# Altium project Feeder.PrjPcb (part 1 of 2)
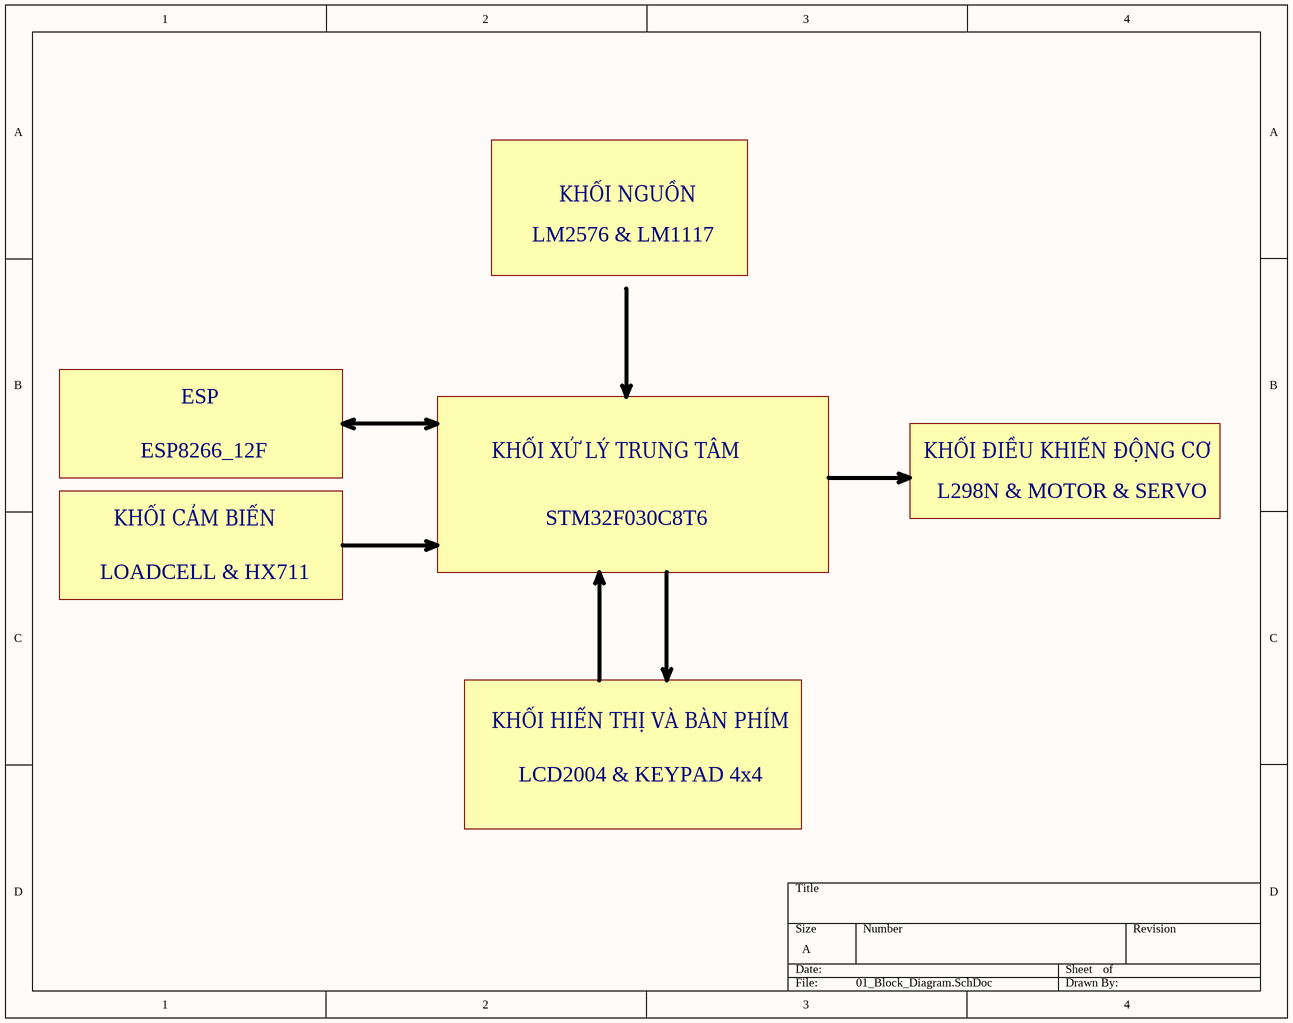
[diagram p0: 01_Block_Diagram.SchDoc]
8 sheets, 125 parts. Net scope: flat (ports and power ports of the same name join across sheets).
Board files: PCB2.PcbDoc, Panel_Feeder.PcbDoc
Sheets:
  01_Block_Diagram.SchDoc
  02_Power_Diagram.SchDoc
  03_MCU.SchDoc
  04_Input.SchDoc
  05_Output.SchDoc
  06_ESP.SchDoc
  07_Power_Supply_AC_to_DC.SchDoc
  08_Power_Supply.SchDoc

## Sheet 01_Block_Diagram.SchDoc
size A; SheetNumber: 1; SheetTotal: 8

### Notes on the sheet
- KHỐI NGUỒN
- LM2576 & LM1117
- ESP
- ESP8266_12F
- KHỐI XỬ LÝ TRUNG TÂM
- KHỐI ĐIỀU KHIỂN ĐỘNG CƠ
- L298N & MOTOR & SERVO
- KHỐI CẢM BIẾN
- STM32F030C8T6
- LOADCELL & HX711
- KHỐI HIỂN THỊ VÀ BÀN PHÍM
- LCD2004 & KEYPAD 4x4

## Sheet 02_Power_Diagram.SchDoc
size A; SheetNumber: 2; SheetTotal: 7
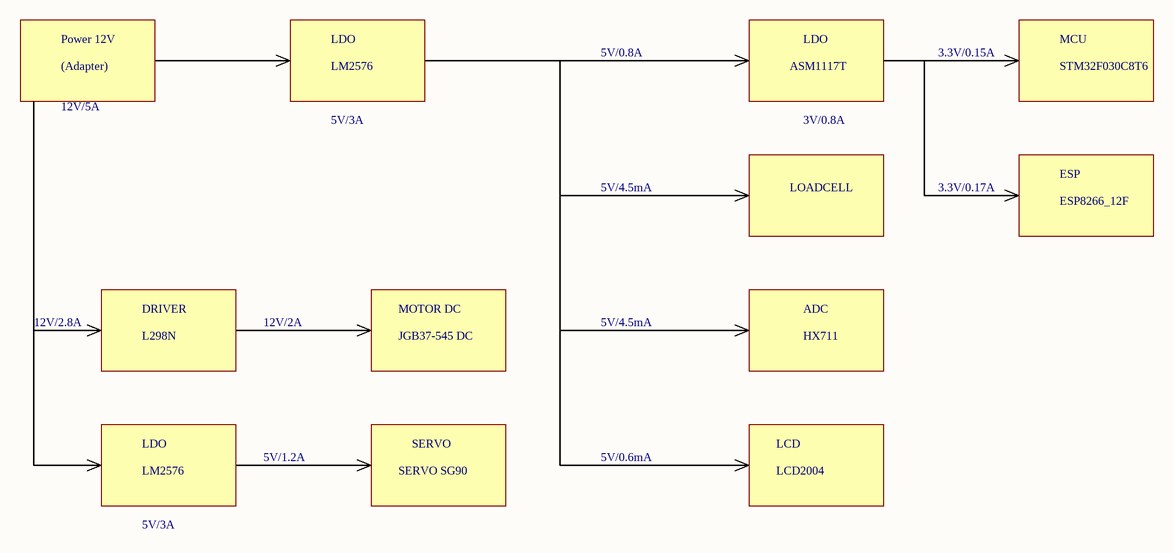
[diagram p1: 02_Power_Diagram.SchDoc]

### Notes on the sheet
- Power 12V
- LDO
- MCU
- (Adapter)
- 12V/5A
- LM2576
- 5V/0.8A
- ASM1117T
- 3.3V/0.15A
- STM32F030C8T6
- 5V/3A
- 3V/0.8A
- ESP
- 5V/4.5mA
- LOADCELL
- 3.3V/0.17A
- ESP8266_12F
- DRIVER
- MOTOR DC
- ADC
- 12V/2.8A
- L298N
- 12V/2A
- JGB37-545 DC
- HX711
- SERVO
- LCD
- 5V/1.2A
- SERVO SG90
- 5V/0.6mA
- LCD2004

## Sheet 03_MCU.SchDoc
size A; SheetNumber: 3; SheetTotal: 8
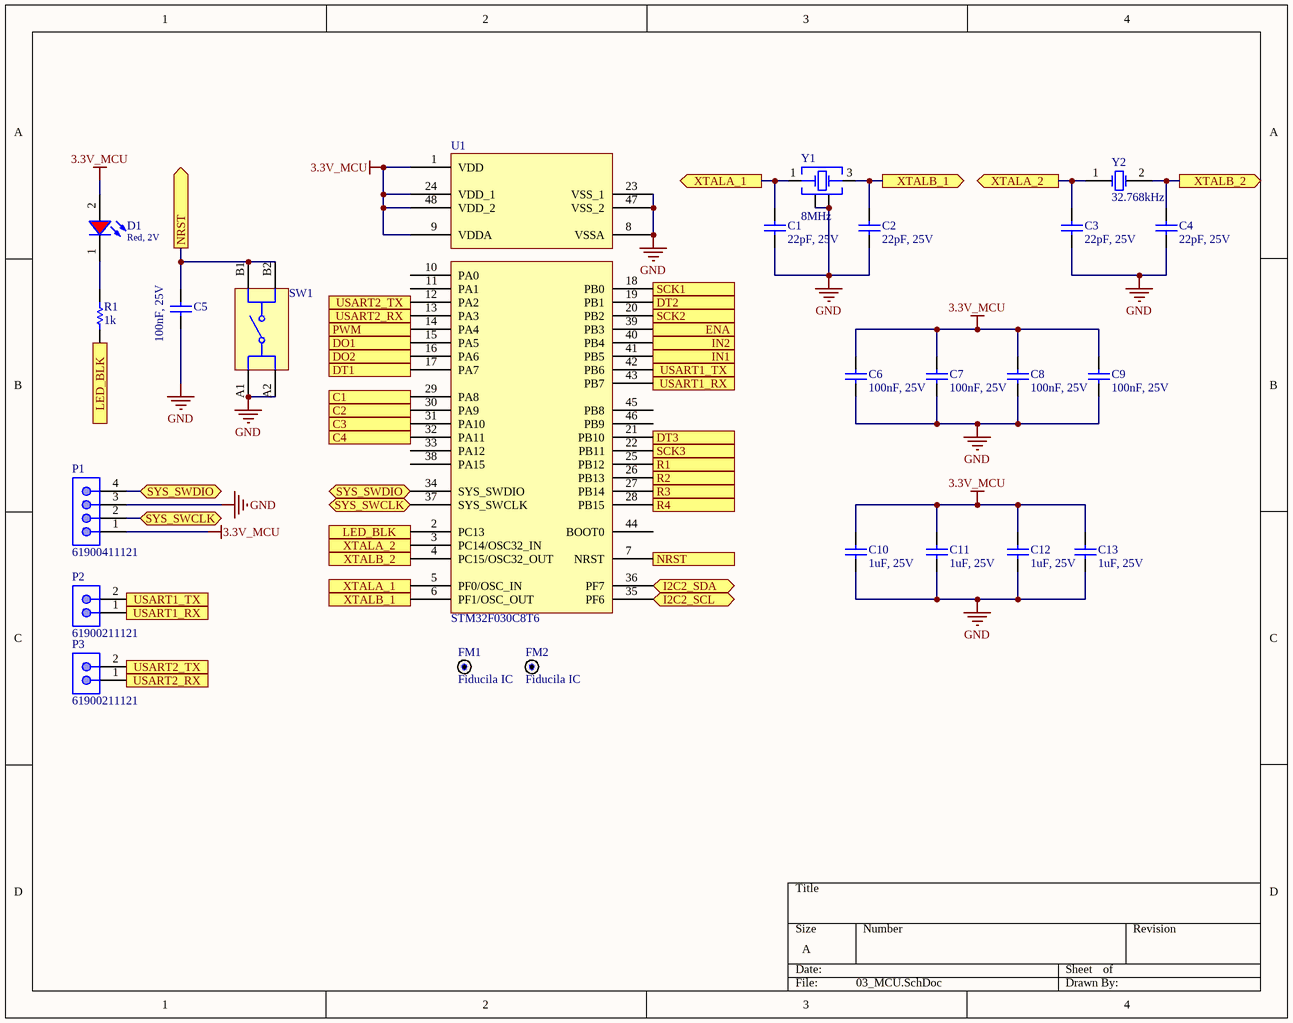
[diagram p2: 03_MCU.SchDoc]

### Parts
C1  22pF, 25V  [WCAP-CSGP_0603_H=0.8mm_Reflow]
C2  22pF, 25V  [WCAP-CSGP_0603_H=0.8mm_Reflow]
C3  22pF, 25V  [WCAP-CSGP_0603_H=0.8mm_Reflow]
C4  22pF, 25V  [WCAP-CSGP_0603_H=0.8mm_Reflow]
C5  100nF, 25V  [WCAP-CSGP_0603_H=0.8mm_Reflow]
C6  100nF, 25V  [WCAP-CSGP_0603_H=0.8mm_Reflow]
C7  100nF, 25V  [WCAP-CSGP_0603_H=0.8mm_Reflow]
C8  100nF, 25V  [WCAP-CSGP_0603_H=0.8mm_Reflow]
C9  100nF, 25V  [WCAP-CSGP_0603_H=0.8mm_Reflow]
C10  1uF, 25V  [WCAP-CSGP_0603_H=0.8mm_Reflow]
C11  1uF, 25V  [WCAP-CSGP_0603_H=0.8mm_Reflow]
C12  1uF, 25V  [WCAP-CSGP_0603_H=0.8mm_Reflow]
C13  1uF, 25V  [WCAP-CSGP_0603_H=0.8mm_Reflow]
D1  Red, 2V  [WL-SMCW_0603_H=0.7mm]
FM1  Fiducila IC  [Fiducial Mark IC]  (no BOM)
FM2  Fiducila IC  [Fiducial Mark IC]  (no BOM)
P1  61900411121  [61900411121]
P2  61900211121  [61900211121]
P3  61900211121  [61900211121]
R1  value 1k  [RES-SM-0603]  (hidden comment: ESR03EZPJ102)
SW1  430152043826  [WS-TASV_L6W6H4.3_4301x20438x6]  (value not drawn)
U1  STM32F030C8T6  [STM32F030C8T6]
Y1  8MHz  [WE-XTAL_CFPX-104]
Y2  32.768kHz  [WE-XTAL_IQXC-90]

### Ports
C1 (in), C2 (in), C3 (in), C4 (in), DO1 (in), DO2 (in), DT1 (in), DT2 (in), DT3 (in), ENA (out), I2C2_SCL (bidir), I2C2_SDA (bidir), IN1 (out), IN2 (out), LED_BLK (in), LED_BLK (out), NRST (in), NRST (out), PWM (out), R1 (in), R2 (in), R3 (in), R4 (in), SCK1 (in), SCK2 (in), SCK3 (in), SYS_SWCLK (bidir), SYS_SWDIO (bidir), USART1_RX (in), USART1_RX (out), USART1_TX (in), USART1_TX (out), USART2_RX (in), USART2_RX (out), USART2_TX (in), USART2_TX (out), XTALA_1 (in), XTALA_1 (out), XTALA_2 (in), XTALA_2 (out), XTALB_1 (in), XTALB_1 (out), XTALB_2 (in), XTALB_2 (out)

### Nets
3.3V_MCU: C6.2 C7.2 C8.2 C9.2 C10.2 C11.2 C12.2 C13.2 D1.2(A) P1.1 U1.1(VDD) U1.9(VDDA) U1.24(VDD_1) U1.48(VDD_2)
GND: C1.1 C2.1 C3.1 C4.1 C5.1 C6.1 C7.1 C8.1 C9.1 C10.1 C11.1 C12.1 C13.1 P1.3 SW1.A1 SW1.A2 U1.8(VSSA) U1.23(VSS_1) U1.47(VSS_2) Y1.2(GND_&_Lid) Y1.4(GND_&_Lid)
NetC1_2: C1.2 U1.5(PF0/OSC_IN) Y1.1(Crystal) ; port XTALA_1
NetC2_2: C2.2 U1.6(PF1/OSC_OUT) Y1.3(Crystal) ; port XTALB_1
NetC3_2: C3.2 U1.3(PC14/OSC32_IN) Y2.1(OSC1) ; port XTALA_2
NetC4_2: C4.2 U1.4(PC15/OSC32_OUT) Y2.2(OSC2) ; port XTALB_2
NetC5_2: C5.2 SW1.B1 SW1.B2 U1.7(NRST) ; port NRST
NetD1_1: D1.1(K) R1.1
NetJ1_3: U1.15(PA5) ; port DO1
NetJ2_3: U1.16(PA6) ; port DO2
NetJ3_1: U1.25(PB12) ; port R1
NetJ3_2: U1.26(PB13) ; port R2
NetJ3_3: U1.27(PB14) ; port R3
NetJ3_4: U1.28(PB15) ; port R4
NetJ3_5: U1.29(PA8) ; port C1
NetJ3_6: U1.30(PA9) ; port C2
NetJ3_7: U1.31(PA10) ; port C3
NetJ3_8: U1.32(PA11) ; port C4
NetJ4_2: U1.17(PA7) ; port DT1
NetJ4_3: U1.18(PB0) ; port SCK1
NetJ5_2: U1.19(PB1) ; port DT2
NetJ5_3: U1.20(PB2) ; port SCK2
NetJ6_2: U1.21(PB10) ; port DT3
NetJ6_3: U1.22(PB11) ; port SCK3
NetJ7_3: U1.35(PF6) ; port I2C2_SCL
NetJ7_4: U1.36(PF7) ; port I2C2_SDA
NetJ9_1: U1.39(PB3) ; port ENA
NetJ9_2: U1.40(PB4) ; port IN2
NetJ9_3: U1.41(PB5) ; port IN1
NetP1_2: P1.2 U1.37(SYS_SWCLK) ; port SYS_SWCLK
NetP1_4: P1.4 U1.34(SYS_SWDIO) ; port SYS_SWDIO
NetP2_1: P2.1 U1.43(PB7) ; port USART1_RX
NetP2_2: P2.2 U1.42(PB6) ; port USART1_TX
NetP3_1: P3.1 U1.13(PA3) ; port USART2_RX
NetP3_2: P3.2 U1.12(PA2) ; port USART2_TX
NetQ1_3: U1.14(PA4) ; port PWM
NetR1_2: R1.2 U1.2(PC13) ; port LED_BLK

Not connected (* = marked no-connect by the designer): U1 10(PA0) 11(PA1) 33(PA12) 38(PA15) 44(BOOT0) 45(PB8) 46(PB9)

### Library data of the parts
C1-C4 = 885012006034: WCAP-CSGP Multilayer Ceramic Chip Capacitor, General Purpose, size 0603, NP0, 22pF, 25V; Manufacturer: Wurth Elektronik; Rated Voltage: 25VDC; Isolation Resistance: >=10GOhm; Capacitance Tolerance: +/-5%; Dissipation Factor: Q>=400+20C; Technical Reference: NP00603220J025DFCT10000; No. Pad (SMD): 2; No. Pad (THT): 0; ComponentLink1Description: Manufacturer; ComponentLink1URL: http://www.we-online.de; ComponentLink2Description: Datasheet; ComponentLink2URL: https://www.we-online.com/catalog/datasheet/885012006034.pdf; Operating Temperature: -55 to +125degC; Packaging: Tape and Reel; Manufacturer Part Number: 885012006034; Published Date: May 2020; Ceramic Type: NP0; Height: 0.8mm; Mounting Technology: SMT; Size: 0603; Capacitance: 22pF; Unit Price (Digikey): 0.1
C5-C9 = 885012206071: WCAP-CSGP Multilayer Ceramic Chip Capacitor, General Purpose, size 0603, X7R, 100nF, 25V; Manufacturer: Wurth Elektronik; Rated Voltage: 25VDC; Isolation Resistance: >=5GOhm; Capacitance Tolerance: +/-10%; Technical Reference: X7R0603104K025DFCT10000; No. Pad (SMD): 2; No. Pad (THT): 0; ComponentLink1Description: Manufacturer; ComponentLink1URL: http://www.we-online.de; ComponentLink2Description: Datasheet; ComponentLink2URL: https://www.we-online.com/catalog/datasheet/885012206071.pdf; Operating Temperature: -55 to +125degC; Packaging: Tape and Reel; Manufacturer Part Number: 885012206071; Published Date: May 2020; Ceramic Type: X7R; Dissipation Factor: =<3.5%; Height: 0.8mm; Mounting Technology: SMT; Size: 0603; Capacitance: 100nF; Unit Price (Digikey): 0.1
C10-C13 = 885012106022: WCAP-CSGP Multilayer Ceramic Chip Capacitor, General Purpose, size 0603, X5R, 1uF, 25V; Manufacturer: Wurth Elektronik; Rated Voltage: 25VDC; Isolation Resistance: >=0.5GOhm; Capacitance Tolerance: +/-20%; Technical Reference: X5R0603105M025DFCT10000; No. Pad (SMD): 2; No. Pad (THT): 0; ComponentLink1Description: Manufacturer; ComponentLink1URL: http://www.we-online.de; ComponentLink2Description: Datasheet; ComponentLink2URL: https://www.we-online.com/catalog/datasheet/885012106022.pdf; Operating Temperature: -55 to +85degC; Packaging: Tape and Reel; Manufacturer Part Number: 885012106022; Published Date: May 2020; Ceramic Type: X5R; Dissipation Factor: =<10%; Height: 0.8mm; Mounting Technology: SMT; Size: 0603; Capacitance: 1uF; Unit Price (Digikey): 0.43
D1 = 150060RS75000: WL-SMCW SMT Mono-color Chip LED Waterclear, size 0603, Red, 2V, 140deg; Chip Technology: AlInGaP; Dominant Wavelength typ.: 625nm; Luminous Intensity typ.: 250mcd; Peak Wavelength typ.: 630nm; No. Pad (SMD): 2; No. Pad (THT): 0; Viewing Angle: 140deg; ComponentLink1Description: Manufacturer; ComponentLink1URL: http://www.we-online.de; ComponentLink2URL: https://www.we-online.com/catalog/datasheet/150060RS75000.pdf; ComponentLink2Description: Datasheet; Forward Voltage typ.: 2V; Emitting Color: Red; Mounting Technology: SMT; Operating Temperature: -40 to +85degC; Published Date: December 2019; Part Number: 150060RS75000; Packaging: Tape and Reel; Size: 0603; Publisher: Wurth Elektronik; Unit Price (Digikey): 0.15
P1 = 61900411121: WR-WTB THT Male Vertical Locking Header, pitch 2.54mm, 4p; Pin Number: 4; Contact Resistance: 20mOhm; Rated Current: 3A; Withstanding Voltage: 1000VAC; Working Voltage: 250VAC; No. Pad (SMD): 0; ComponentLink1Description: Manufacturer; ComponentLink1URL: http://www.we-online.de; ComponentLink2Description: Datasheet; ComponentLink2URL: https://www.we-online.com/catalog/datasheet/61900411121.pdf; Pitch: 2.54mm; Published Date: January 2020; Publisher: Wurth Elektronik; Mounting Technology: THT; Packaging: Bag; Operating Temperature: -40 to +105degC; Part Number: 61900411121; Gender: Male; Type: Vertical; No. Pad (THT): 4; Unit Price (Digikey): 0.94
P2 P3 = 61900211121: WR-WTB THT Male Vertical Locking Header, pitch 2.54mm, 2p; Pin Number: 2; Contact Resistance: 20mOhm; Rated Current: 3A; Withstanding Voltage: 1000VAC; Working Voltage: 250VAC; No. Pad (SMD): 0; ComponentLink1Description: Manufacturer; ComponentLink1URL: http://www.we-online.de; ComponentLink2Description: Datasheet; ComponentLink2URL: https://www.we-online.com/catalog/datasheet/61900211121.pdf; Pitch: 2.54mm; Published Date: January 2020; Publisher: Wurth Elektronik; Mounting Technology: THT; Packaging: Bag; Operating Temperature: -40 to +105degC; Part Number: 61900211121; Gender: Male; Type: Vertical; No. Pad (THT): 2; Unit Price (Digikey): 0.56
R1 = RESISTOR SMD: RES SMD 1K OHM 5% 1/4W 0603; Mfr: Rohm Semiconductor; No. Pad (SMD): 2; No. Pad (THT): 0; Resistance: 1 kOhms; Power (Watts): 0.25W, 1/4W; Temperature Coefficient: ±200ppm/°C; Unit Price (Digikey): 0.14; Series: ESR; Tolerance: ±5%; Composition: Thick Film; Features: Automotive AEC-Q200, Pulse Withstanding; Operating Temperature: -55°C ~ 155°C; Package / Case: 0603 (1608 Metric); Supplier Device Package: 0603; Ratings: AEC-Q200; Size / Dimension: 0.063" L x 0.031" W (1.60mm x 0.80mm); Number of Terminations: 2; Height - Seated (Max): 0.022" (0.55mm); ComponentLink1Description: Digikey; ComponentLink1URL: https://www.digikey.com/en/products/detail/rohm-semiconductor/ESR03EZPJ102/1762721?s=N4IgTCBcDaIKIGUBKAGAzHAWgBQFIEYUIBdAXyA
SW1 = 430152043826: WS-TASV SMT Tact Switch, 12VDC, 50mA, 260g, height 4.3mm; Manufacturer: Wurth Elektronik; Rated Voltage: 12V; Washable: No; Actuator Color: White; Electrical Life: 200000Cycles; No. Pad (SMD): 4; No. Pad (THT): 0; ComponentLink1Description: Manufacturer Link; ComponentLink1URL: http://www.we-online.de; ComponentLink2Description: Datasheet; ComponentLink2URL: https://www.we-online.com/catalog/datasheet/430152043826.pdf; Manufacturer Part Number: 430152043826; Contact Material: Stainless Steel; Mounting Technology: SMT; Contact Plating: Silver; Operation Force: 260g; Packaging: Tape and Reel; Terminal Material: Copper Alloy; Rated Current: 50mA; Terminal Plating: Silver; Height: 4.3mm; Length: 6mm; Operating Temperature max.: 85C; Operating Temperature min.: -40C; Width: 6mm; Unit Price (Digikey): 0.53
U1 = STM32F030C8T6: / ARM® Cortex®-M0 series Microcontroller IC 32-Bit Single-Core 48MHz 64KB (64K x 8) FLASH 48-LQFP (7x7); Mfr: STMicroelectronics; Connectivity: I²C, SPI, UART/USART; Peripherals: DMA, POR, PWM, WDT; Number of I/O: 39; RAM Size: 8K x 8; Voltage - Supply (Vcc/Vdd): 2.4V ~ 3.6V; Data Converters: A/D 12x12b; Oscillator Type: Internal; No. Pad (SMD): 48; No. Pad (THT): 0; Core Processor: ARM® Cortex®-M0; Core Size: 32-Bit Single-Core; Speed: 48MHz; Program Memory Size: 64KB (64K x 8); Program Memory Type: FLASH; Operating Temperature: -40°C ~ 85°C (TA); Mounting Type: Surface Mount; Supplier Device Package: 48-LQFP (7x7); ComponentLink1Description: Digikey; ComponentLink1URL: https://www.digikey.com/en/products/detail/stmicroelectronics/STM32F030C8T6/4357252; Unit Price (Digikey): 3.25
Y1 = 830055663: WE-XTAL Quartz Crystal, SMT, CFPX-104, 8MHz, +/-20ppm; Manufacturer: Wurth Elektronik; Frequency Stability: +/-30ppm; Load Capacitance: 18pF; No. Pad (SMD): 4; No. Pad (THT): 0; ComponentLink1Description: Manufacturer; ComponentLink1URL: http://www.we-online.de; ComponentLink2Description: Datasheet; ComponentLink2URL: https://katalog.we-online.com/pbs/datasheet/830055663.pdf; Operating Temperature: -40 to +85degC; Packaging: Tape and Reel; Manufacturer Part Number: 830055663; Published Date: July 2020; Size: CFPX-104; Frequency: 8MHz; Frequency Tolerance: +/-20ppm; Mounting Technology: SMT; Unit Price (Digikey): 0.65
Y2 = 830066431: WE-XTAL Watch Crystal, SMT, IQXC-90, 32.768kHz, +/-20ppm; Manufacturer: Wurth Elektronik; Load Capacitance: 7pF; No. Pad (SMD): 2; No. Pad (THT): 0; ComponentLink1Description: Manufacturer; ComponentLink1URL: http://www.we-online.de; ComponentLink2Description: Datasheet; ComponentLink2URL: https://katalog.we-online.com/pbs/datasheet/830066431.pdf; Operating Temperature: -40 to +85degC; Packaging: Tape and Reel; Manufacturer Part Number: 830066431; Published Date: July 2020; Size: IQXC-90; Frequency Stability: -; Frequency: 32.768kHz; Frequency Tolerance: +/-20ppm; Mounting Technology: SMT; Unit Price (Digikey): 1.75

## Sheet 04_Input.SchDoc
size A; SheetNumber: 4; SheetTotal: 8
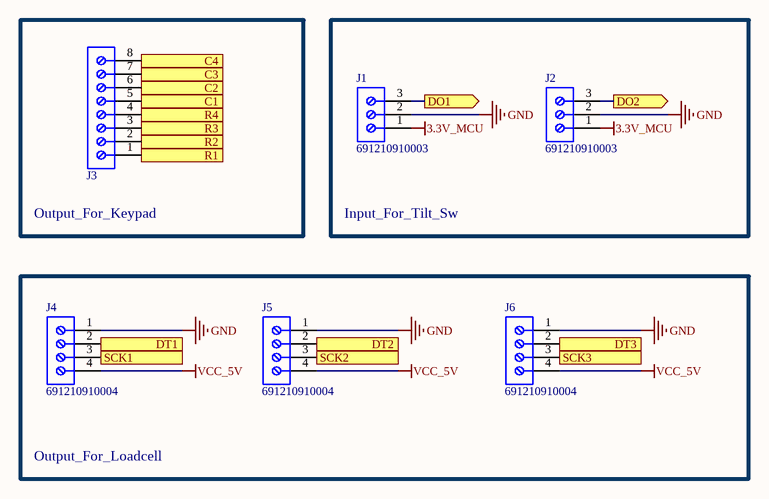
[diagram p3: 04_Input.SchDoc]

### Parts
J1  691210910003  [691210910003]
J2  691210910003  [691210910003]
J3  691210910008  [691210910008]  (value not drawn)
J4  691210910004  [691210910004]
J5  691210910004  [691210910004]
J6  691210910004  [691210910004]

### Blocks framed on the sheet
Output_For_Keypad: J3
Input_For_Tilt_Sw: J1 J2
Output_For_Loadcell: J4-J6

### Ports
C1 (out), C2 (out), C3 (out), C4 (out), DO1 (out), DO2 (out), DT1 (out), DT2 (out), DT3 (out), R1 (out), R2 (out), R3 (out), R4 (out), SCK1 (out), SCK2 (out), SCK3 (out)

### Nets
3.3V_MCU: J1.1 J2.1
GND: J1.2 J2.2 J4.1 J5.1 J6.1
VCC_5V: J4.4 J5.4 J6.4
NetJ1_3: J1.3 ; port DO1
NetJ2_3: J2.3 ; port DO2
NetJ3_1: J3.1 ; port R1
NetJ3_2: J3.2 ; port R2
NetJ3_3: J3.3 ; port R3
NetJ3_4: J3.4 ; port R4
NetJ3_5: J3.5 ; port C1
NetJ3_6: J3.6 ; port C2
NetJ3_7: J3.7 ; port C3
NetJ3_8: J3.8 ; port C4
NetJ4_2: J4.2 ; port DT1
NetJ4_3: J4.3 ; port SCK1
NetJ5_2: J5.2 ; port DT2
NetJ5_3: J5.3 ; port SCK2
NetJ6_2: J6.2 ; port DT3
NetJ6_3: J6.3 ; port SCK3

### Library data of the parts
J1 J2 = 691210910003: WR-TBL Serie 2109 Horizontal Entry, Rising Cage Clamp, pitch 2.54mm, 3p; Compliance: Lead free / RoHS; Modularity: No; PCB/Cable/Panel: PCB; Pin Number: 3; Rated Current [UL]: 6A; Working Voltage [UL]: 150VAC; No. Pad (SMD): 0; ComponentLink1Description: Manufacturer; ComponentLink1URL: http://www.we-online.de; ComponentLink2URL: https://katalog.we-online.de/em/datasheet/691210910003.pdf; ComponentLink2Description: Datasheet; Mounting Technology: THT; Part Number: 691210910003; Packaging: Box; Operating Temperature: -40 to +105degC; Pitch: 2.54mm; Published Date: October 2019; Type: Horizontal; Publisher: Wurth Elektronik; Application: Rising Cage Clamp; No. Pad (THT): 3; Unit Price (Digikey): 1.55
J3 = 691210910008: WR-TBL Series 2109 Horizontal Entry, Through Hole, pitch 2.54mm, 8p; Manufacturer: Wurth Elektronik; Pin Number: 8; Rated Current: 6A; Working Voltage: 150V; PCB/Cable/Panel: PCB; Modularity: No; No. Pad (SMD): 0; ComponentLink1Description: Manufacturer Link; ComponentLink1URL: https://www.we-online.com/redexpert/article/691210910008?ad; ComponentLink2Description: Datasheet; ComponentLink2URL: https://www.we-online.com/redexpert/spec/691210910008?ad; Category: Terminal Blocks; Match Code: WR-TBL; Manufacturer Part Number: 691210910008; Mount: Through Hole; Operating Temperature Max: 105°C; Operating Temperature Min: -40°C; Packaging: Box; Pitch: 2.54mm; Orientation: Horizontal; Application: Rising Cage Clamp; No. Pad (THT): 8; Unit Price (Digikey): 3.93
J4-J6 = 691210910004: WR-TBL Serie 2109 Horizontal Entry, Rising Cage Clamp, pitch 2.54mm, 4p; Compliance: Lead free / RoHS; Modularity: No; PCB/Cable/Panel: PCB; Pin Number: 4; Rated Current [UL]: 6A; Working Voltage [UL]: 150VAC; No. Pad (SMD): 0; ComponentLink1Description: Manufacturer; ComponentLink1URL: http://www.we-online.de; ComponentLink2URL: https://katalog.we-online.de/em/datasheet/691210910004.pdf; ComponentLink2Description: Datasheet; Mounting Technology: THT; Part Number: 691210910004; Packaging: Box; Operating Temperature: -40 to +105degC; Pitch: 2.54mm; Published Date: October 2019; Type: Horizontal; Publisher: Wurth Elektronik; Application: Rising Cage Clamp; No. Pad (THT): 4; Unit Price (Digikey): 1.96

## Sheet 05_Output.SchDoc
size A; SheetNumber: 5; SheetTotal: 8
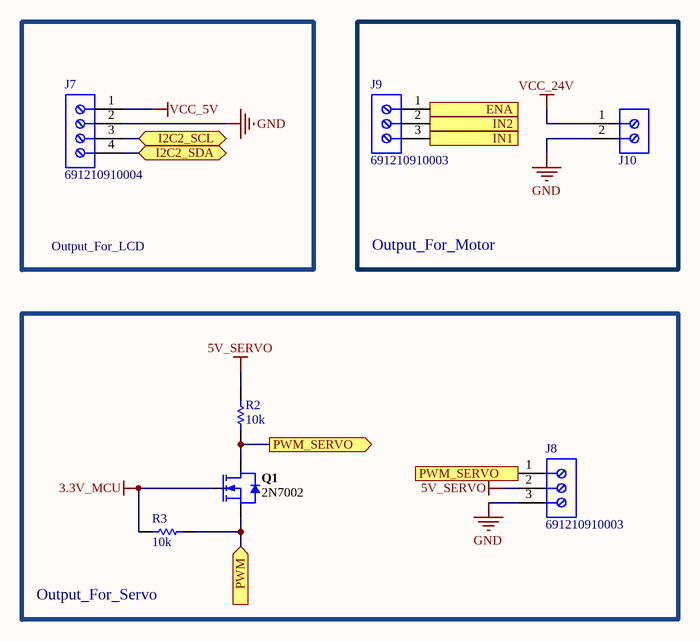
[diagram p4: 05_Output.SchDoc]

### Parts
J7  691210910004  [691210910004]
J8  691210910003  [691210910003]
J9  691210910003  [691210910003]
J10  691137710002  [691137710002]  (value not drawn)
Q1  2N7002  [SOT23-123]
R2  value 10k  [RES-SM-0603]  (hidden comment: ESR03EZPF1002)
R3  value 10k  [RES-SM-0603]  (hidden comment: ESR03EZPF1002)

### Blocks framed on the sheet
Output_For_LCD: J7
Output_For_Motor: J9 J10
Output_For_Servo: J8 Q1 R2 R3

### Ports
ENA (in), I2C2_SCL (bidir), I2C2_SDA (bidir), IN1 (in), IN2 (in), PWM (in), PWM_SERVO (in), PWM_SERVO (out)

### Nets
3.3V_MCU: Q1.1(G) R3.1
5V_SERVO: J8.2 R2.2
GND: J7.2 J8.3 J10.2
VCC_5V: J7.1
VCC_24V: J10.1
NetJ7_3: J7.3 ; port I2C2_SCL
NetJ7_4: J7.4 ; port I2C2_SDA
NetJ8_1: J8.1 Q1.2(D) R2.1 ; port PWM_SERVO
NetJ9_1: J9.1 ; port ENA
NetJ9_2: J9.2 ; port IN2
NetJ9_3: J9.3 ; port IN1
NetQ1_3: Q1.3(S) R3.2 ; port PWM

### Library data of the parts
J7 = 691210910004: as J4 on sheet 04_Input; ComponentLink1Description: Manufacturer; ComponentLink1URL: http://www.we-online.de; ComponentLink2URL: https://katalog.we-online.de/em/datasheet/691210910004.pdf; ComponentLink2Description: Datasheet; Mounting Technology: THT; Part Number: 691210910004; Packaging: Box; Operating Temperature: -40 to +105degC; Pitch: 2.54mm; Published Date: October 2019; Type: Horizontal; Publisher: Wurth Elektronik; Application: Rising Cage Clamp; No. Pad (THT): 4; Unit Price (Digikey): 1.96
J8 J9 = 691210910003: as J1 on sheet 04_Input; ComponentLink1Description: Manufacturer; ComponentLink1URL: http://www.we-online.de; ComponentLink2URL: https://katalog.we-online.de/em/datasheet/691210910003.pdf; ComponentLink2Description: Datasheet; Mounting Technology: THT; Part Number: 691210910003; Packaging: Box; Operating Temperature: -40 to +105degC; Pitch: 2.54mm; Published Date: October 2019; Type: Horizontal; Publisher: Wurth Elektronik; Application: Rising Cage Clamp; No. Pad (THT): 3; Unit Price (Digikey): 1.55
J10 = 691137710002: WR-TBL Series 1377 Horizontal Entry, Through Hole, pitch 5mm, 2p; Manufacturer: Wurth Elektronik; Pin Number: 2; Rated Current: 16A; Working Voltage: 300V; PCB/Cable/Panel: PCB; Modularity: No; No. Pad (SMD): 0; ComponentLink1Description: Manufacturer Link; ComponentLink1URL: https://www.we-online.com/redexpert/article/691137710002?ad; ComponentLink2Description: Datasheet; ComponentLink2URL: https://www.we-online.com/redexpert/spec/691137710002?ad; Category: Terminal Blocks; Match Code: WR-TBL; Manufacturer Part Number: 691137710002; Mount: Through Hole; Operating Temperature Max: 120°C; Operating Temperature Min: -30°C; Packaging: Box; Pitch: 5mm; Orientation: Horizontal; Application: Pressure Clamp; No. Pad (THT): 2; Unit Price (Digikey): 0.41
Q1 = 2N7002: N-Channel 60 V 340mA (Ta) 350mW (Ta) Surface Mount SOT-23; Mfr: Yangzhou Yangjie Electronic Technology Co.,Ltd; Transistor Type: NPN; No. Pad (SMD): 3; No. Pad (THT): 0; Drain to Source Voltage (Vdss): 60 V; Drive Voltage (Max Rds On, Min Rds On): 4.5V, 10V; Rds On (Max) @ Id, Vgs: 2.5Ohm @ 300mA, 10V; Vgs(th) (Max) @ Id: 2.5V @ 250µA; Gate Charge (Qg) (Max) @ Vgs: 1.6 nC @ 10 V; Vgs (Max): ±30V; Input Capacitance (Ciss) (Max) @ Vds: 27.5 pF @ 30 V; Parameter 3: Package / Case; Mounting Technology: Surface Mount; Status: Unreleased; Category: Transistor-FET; Unit Price (Digikey): 0.29; ComponentLink1Description: Digikey; ComponentLink1URL: https://www.digikey.com/en/products/detail/yangzhou-yangjie-electronic-technology-co-ltd/2N7002/13911639; FET Type: N-Channel; Technology: MOSFET (Metal Oxide); Current - Continuous Drain (Id) @ 25°C: 340mA (Ta); Power Dissipation (Max): 350mW (Ta); Operating Temperature: -55°C ~ 150°C (TJ); Mounting Type: Surface Mount; Supplier Device Package: SOT-23
R2 R3 = RESISTOR SMD: RES SMD 10K OHM 1% 1/4W 0603; Mfr: Rohm Semiconductor; No. Pad (SMD): 2; No. Pad (THT): 0; Resistance: 10 kOhms; Power (Watts): 0.25W, 1/4W; Temperature Coefficient: ±100ppm/°C; Ratings: AEC-Q200*; Unit Price (Digikey): 0.15; Category: Resistors; Series: ESR; Tolerance: ±1%; Composition: Thick Film; Features: Automotive AEC-Q200, Pulse Withstanding; Operating Temperature: -55°C ~ 155°C; Package / Case: 0603 (1608 Metric); Supplier Device Package: 0603; Size / Dimension: 0.063" L x 0.031" W (1.60mm x 0.80mm); Height - Seated (Max): 0.022" (0.55mm); Number of Terminations: 2

## Sheet 06_ESP.SchDoc
size A; SheetNumber: 6; SheetTotal: 8
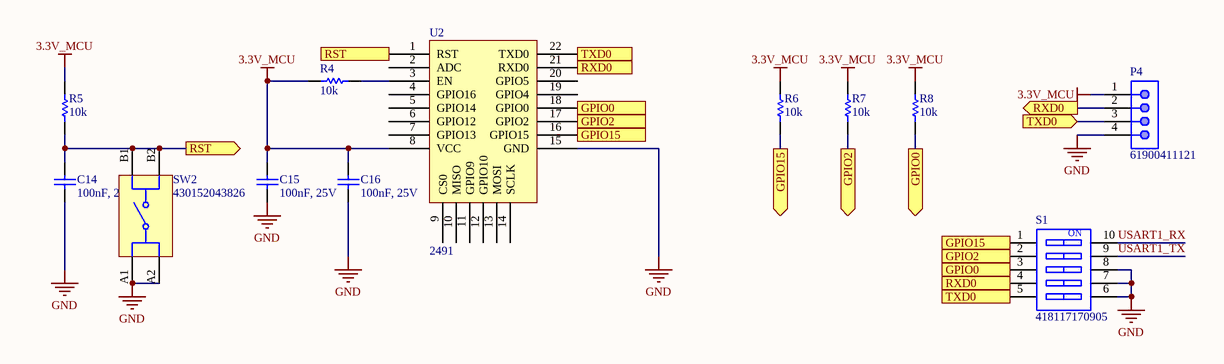
[diagram p5: 06_ESP.SchDoc]

### Parts
C14  100nF, 25V  [WCAP-CSGP_0603_H=0.8mm_Reflow]
C15  100nF, 25V  [WCAP-CSGP_0603_H=0.8mm_Reflow]
C16  100nF, 25V  [WCAP-CSGP_0603_H=0.8mm_Reflow]
P4  61900411121  [61900411121]
R4  value 10k  [RES-SM-0603]  (hidden comment: ESR03EZPF1002)
R5  value 10k  [RES-SM-0603]  (hidden comment: ESR03EZPF1002)
R6  value 10k  [RES-SM-0603]  (hidden comment: ESR03EZPF1002)
R7  value 10k  [RES-SM-0603]  (hidden comment: ESR03EZPF1002)
R8  value 10k  [RES-SM-0603]  (hidden comment: ESR03EZPF1002)
S1  418117170905  [418117170905]
SW2  430152043826  [WS-TASV_L6W6H4.3_4301x20438x6]
U2  2491  [ESP8266]

### Ports
GPIO0 (in), GPIO0 (out), GPIO2 (in), GPIO2 (out), GPIO15 (in), GPIO15 (out), RST (in), RST (out), RXD0 (in), RXD0 (out), TXD0 (in), TXD0 (out)

### Nets
3.3V_MCU: C15.2 C16.2 P4.1 R4.1 R5.1 R6.1 R7.1 R8.1 U2.8(VCC)
GND: C14.1 C15.1 C16.1 P4.4 S1.6 S1.7 S1.8 SW2.A1 SW2.A2 U2.15(GND)
USART1_RX: S1.10
USART1_TX: S1.9
NetC14_2: C14.2 R5.2 SW2.B1 SW2.B2 U2.1(RST) ; port RST
NetP4_2: P4.2 S1.4 U2.21(RXD0) ; port RXD0
NetP4_3: P4.3 S1.5 U2.22(TXD0) ; port TXD0
NetR4_2: R4.2 U2.3(EN)
NetR6_2: R6.2 S1.1 U2.16(GPIO15) ; port GPIO15
NetR7_2: R7.2 S1.2 U2.17(GPIO2) ; port GPIO2
NetR8_2: R8.2 S1.3 U2.18(GPIO0) ; port GPIO0

Not connected (* = marked no-connect by the designer): U2 2(ADC) 4(GPIO16) 5(GPIO14) 6(GPIO12) 7(GPIO13) 9(CS0) 10(MISO) 11(GPIO9) 12(GPIO10) 13(MOSI) 14(SCLK) 19(GPIO4) 20(GPIO5)

### Notes on the sheet
- (in symbol 418117170905) ON

### Library data of the parts
C14-C16 = 885012206071: as C5 on sheet 03_MCU; ComponentLink1Description: Manufacturer; ComponentLink1URL: http://www.we-online.de; ComponentLink2Description: Datasheet; ComponentLink2URL: https://www.we-online.com/catalog/datasheet/885012206071.pdf; Operating Temperature: -55 to +125degC; Packaging: Tape and Reel; Manufacturer Part Number: 885012206071; Published Date: May 2020; Ceramic Type: X7R; Dissipation Factor: =<3.5%; Height: 0.8mm; Mounting Technology: SMT; Size: 0603; Capacitance: 100nF; Unit Price (Digikey): 0.1
P4 = 61900411121: as P1 on sheet 03_MCU; ComponentLink1Description: Manufacturer; ComponentLink1URL: http://www.we-online.de; ComponentLink2Description: Datasheet; ComponentLink2URL: https://www.we-online.com/catalog/datasheet/61900411121.pdf; Pitch: 2.54mm; Published Date: January 2020; Publisher: Wurth Elektronik; Mounting Technology: THT; Packaging: Bag; Operating Temperature: -40 to +105degC; Part Number: 61900411121; Gender: Male; Type: Vertical; No. Pad (THT): 4; Unit Price (Digikey): 0.94
R4-R8 = RESISTOR SMD: as R2 on sheet 05_Output; Unit Price (Digikey): 0.15; Category: Resistors; Series: ESR; Tolerance: ±1%; Composition: Thick Film; Features: Automotive AEC-Q200, Pulse Withstanding; Operating Temperature: -55°C ~ 155°C; Package / Case: 0603 (1608 Metric); Supplier Device Package: 0603; Size / Dimension: 0.063" L x 0.031" W (1.60mm x 0.80mm); Height - Seated (Max): 0.022" (0.55mm); Number of Terminations: 2
S1 = 418117170905: WS-DITV Compact THT Dip Switch, Flat Actuator, pitch 2.54mm, 5p; Operation Force: 800g; Pole Number: 5; Actuator Type: Flat Type; Circuit: SPST-NO; Rated Current Switching: 25mA; Rated Current Non-Switching: 100mA; Rated Voltage Non-Switching: 50VDC; Rated Voltage Switching: 24VDC; No. Pad (SMD): 0; No. Pad (THT): 10; ComponentLink1Description: Manufacturer; ComponentLink1URL: http://www.we-online.de; ComponentLink2Description: Datasheet; ComponentLink2URL: https://katalog.we-online.com/em/datasheet/418117170905.pdf; Pitch: 2.54mm; Contact Material: Copper Alloy; Mounting Technology: THT; Operating Temperature: -40 to +85degC; Contact Plating: Gold; Packaging: Tube; Part Number: 418117170905; Publisher: Wurth Elektronik; Published Date: September 2019; Unit Price (Digikey): 2.13
SW2 = 430152043826: as SW1 on sheet 03_MCU; ComponentLink1Description: Manufacturer Link; ComponentLink1URL: http://www.we-online.de; ComponentLink2Description: Datasheet; ComponentLink2URL: https://www.we-online.com/catalog/datasheet/430152043826.pdf; Manufacturer Part Number: 430152043826; Contact Material: Stainless Steel; Mounting Technology: SMT; Contact Plating: Silver; Operation Force: 260g; Packaging: Tape and Reel; Terminal Material: Copper Alloy; Rated Current: 50mA; Terminal Plating: Silver; Height: 4.3mm; Length: 6mm; Operating Temperature max.: 85C; Operating Temperature min.: -40C; Width: 6mm; Unit Price (Digikey): 0.53
U2 = ESP8266: WiFi 802.11b/g/n Transceiver Module 2.4GHz ~ 2.5GHz Integrated, Trace Surface Mount; Mfr: Adafruit Industries LLC; No. Pad (SMD): 22; No. Pad (THT): 0; Data Rate: 72.2Mbps; Power - Output: 20.5dBm; Sensitivity: -98dBm; Serial Interfaces: I²C, I²S, SDIO, SPI, UART; Memory Size: 4MB Flash; Voltage - Supply: 3V ~ 3.6V; Current - Receiving: 50mA ~ 56mA; Current - Transmitting: 120mA ~ 170mA; Unit Price (Digikey): 6.95; ComponentLink1Description: Digikey; ComponentLink1URL: https://www.digikey.com/en/products/detail/adafruit-industries-llc/2491/5761206; Category: RF/IF and RFID; RF Family/Standard: WiFi; Protocol: 802.11b/g/n; Frequency: 2.4GHz ~ 2.5GHz; Antenna Type: Integrated, Trace; Utilized IC / Part: ESP8266; Mounting Type: Surface Mount; Operating Temperature: -40°C ~ 125°C; Package / Case: Module